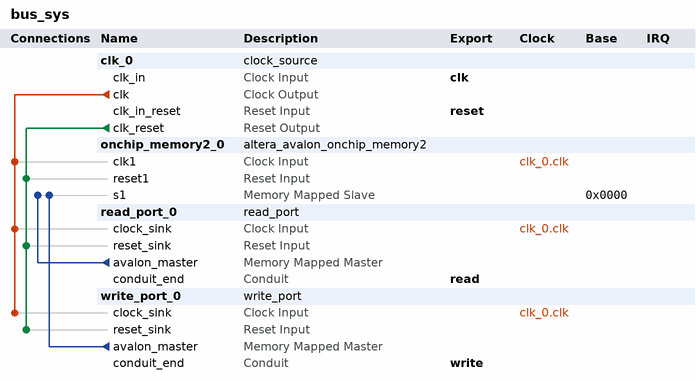
[diagram p0: system contents]
# Platform Designer (Qsys) system bus_sys, Stratix III EP3SL150F1152C2
# Parameters at their usual value, and those the tool derives, are not listed.
package require -exact qsys 13.0
create_system bus_sys
set_project_property DEVICE_FAMILY {Stratix III}
set_project_property DEVICE EP3SL150F1152C2

add_instance clk_0 clock_source 13.0
set_instance_parameter_value clk_0 clockFrequency 50000000

add_instance onchip_memory2_0 altera_avalon_onchip_memory2 13.0.1.99.2
set_instance_parameter_value onchip_memory2_0 dataWidth 32
set_instance_parameter_value onchip_memory2_0 dualPort false
set_instance_parameter_value onchip_memory2_0 initMemContent true
set_instance_parameter_value onchip_memory2_0 initializationFileName "E:\\University of Toronto\\masters\\isp\\isp\\test\\bus\\onchip_mem.hex"
set_instance_parameter_value onchip_memory2_0 memorySize 153600

add_instance read_port_0 read_port 1.0
set_instance_parameter_value read_port_0 DATAWIDTH 32
set_instance_parameter_value read_port_0 BYTEENABLEWIDTH 4
set_instance_parameter_value read_port_0 ADDRESSWIDTH 30

add_instance write_port_0 write_port 1.0
set_instance_parameter_value write_port_0 DATAWIDTH 32
set_instance_parameter_value write_port_0 BYTEENABLEWIDTH 4
set_instance_parameter_value write_port_0 ADDRESSWIDTH 30

# connections
add_connection clk_0.clk onchip_memory2_0.clk1 clock
add_connection clk_0.clk read_port_0.clock_sink clock
add_connection clk_0.clk write_port_0.clock_sink clock
add_connection clk_0.clk_reset onchip_memory2_0.reset1 reset
add_connection clk_0.clk_reset read_port_0.reset_sink reset
add_connection clk_0.clk_reset write_port_0.reset_sink reset
add_connection read_port_0.avalon_master onchip_memory2_0.s1 avalon
set_connection_parameter_value read_port_0.avalon_master/onchip_memory2_0.s1 baseAddress 0x0000
add_connection write_port_0.avalon_master onchip_memory2_0.s1 avalon
set_connection_parameter_value write_port_0.avalon_master/onchip_memory2_0.s1 baseAddress 0x0000

# exported interfaces
add_interface clk clock sink
set_interface_property clk EXPORT_OF clk_0.clk_in
add_interface reset reset sink
set_interface_property reset EXPORT_OF clk_0.clk_in_reset
add_interface read conduit end
set_interface_property read EXPORT_OF read_port_0.conduit_end
add_interface write conduit end
set_interface_property write EXPORT_OF write_port_0.conduit_end

set_interconnect_requirement {$system} qsys_mm.clockCrossingAdapter HANDSHAKE
set_interconnect_requirement {$system} qsys_mm.maxAdditionalLatency 1

save_system bus_sys.qsys
